# Altium schematic sheet BL Touch ABL sensor.SchDoc
size A4; SheetNumber: 7; SheetTotal: 7
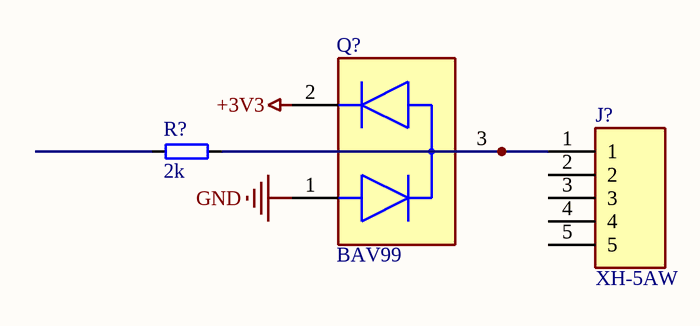
[diagram p0: BL Touch ABL sensor.SchDoc]

## Parts
J?  XH-5AW  [XH-5AW]
Q?  BAV99  [SOT95P280X120-3N]
R?  2k  [RESC1005X35N]

## Nets
+3V3: Q?.2
GND: Q?.1
NetJ?_1: J?.1 Q?.3 R?.2

Not connected (* = marked no-connect by the designer): J? 2 3 4 5; R? 1

## Library data of the parts
J? = XH-5AW: 1x5P XH 1 2.54mm Male pin 5 -25℃~+85℃ 3A Shrouded Push-Pull,P=2.54mm Wire To Board / Wire To Wire Connector ROHS; MANUFACTURER: HCTL; Part Number: XH-5AW; COMPONENTLINK1URL: https://datasheet.lcsc.com/lcsc/2110211930_HCTL-XH-5AW_C2908614.pdf; COMPONENTLINK1DESCRIPTION: Datasheet; PACKAGE: TH; Part Status: Active
Q? = BAV99: MANUFACTURER: FOSAN; Part Number: BAV99; COMPONENTLINK1URL: https://datasheet.lcsc.com/lcsc/2112031830_FOSAN-BAV99_C2926147.pdf; COMPONENTLINK1DESCRIPTION: Datasheet; PACKAGE: SOT23-3; Part Status: Active
R? = WR04X2001FTL: Resistor; Manufacturer: Walsin Tech Corp; Tolerance: 1%; Power: 1/16 W; Temperature Coefficient: 100ppm; Min Temperature: -55°C; Max Temperature: 155°C; Part Number: WR04X2001FTL; ComponentLink1URL: https://datasheet.lcsc.com/lcsc/1810191630_Walsin-Tech-Corp-WR04X2001FTL_C163822.pdf; ComponentLink1Description: Datasheet; Package: 0402; Part Status: Active; Resistance: 2k